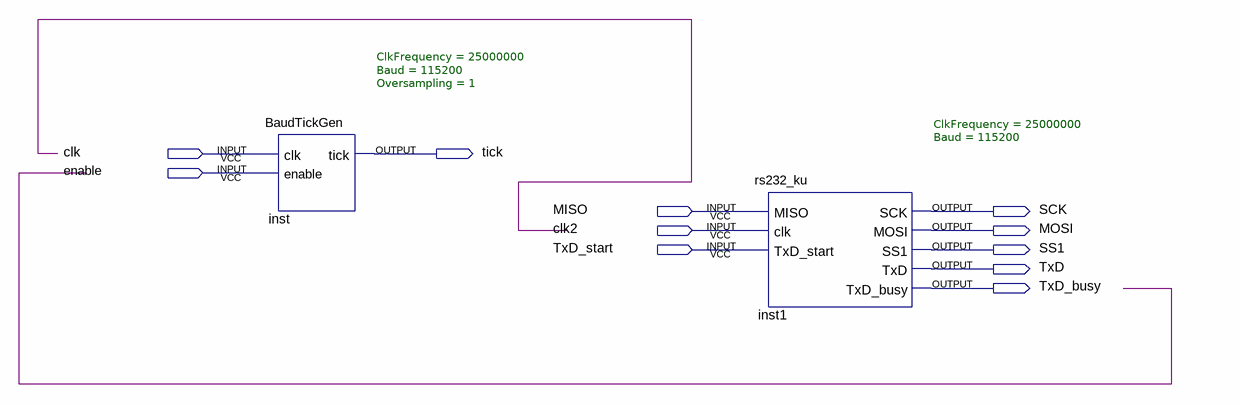
[diagram p0: schematic sheet]
// Quartus schematic Block1.bdf as structural Verilog: 2 symbols, 11 pins
module Block1 (
  input  clk,
  input  enable,
  input  MISO,
  input  clk2,
  input  TxD_start,
  output tick,
  output SCK,
  output MOSI,
  output SS1,
  output TxD,
  output TxD_busy
);

  BaudTickGen #(.ClkFrequency(25000000), .Baud(115200), .Oversampling(1)) inst (
    .clk(clk), .enable(enable), .tick(tick));
  rs232_ku #(.ClkFrequency(25000000), .Baud(115200)) inst1 (
    .MISO(MISO), .clk(clk2), .TxD_start(TxD_start), .SCK(SCK), .MOSI(MOSI), .SS1(SS1), .TxD(TxD),
    .TxD_busy(TxD_busy));
endmodule
